# EAGLE schematic resist (EAGLE 5.91)
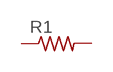
[diagram p0: schematic, sheet 1]

## Parts
R1  R-US_R0805  [R0805]
Unconnected: R1.1 R1.2

## Library data of the parts
R1 = resistor:R-US_: RESISTOR, American symbol